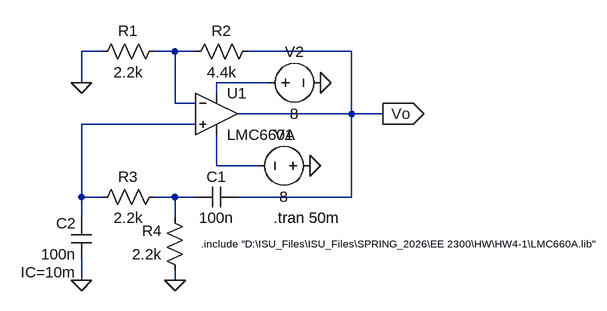
[diagram p0: schematic P4d.asc]
P4d.asc, the LTspice schematic file:
Version 4.1
SHEET 1 1140 680
WIRE 0 80 -32 80
WIRE 112 80 80 80
WIRE 144 80 112 80
WIRE 384 80 224 80
WIRE -32 128 -32 80
WIRE 256 128 176 128
WIRE 176 144 176 128
WIRE 112 160 112 80
WIRE 144 160 112 160
WIRE 384 176 384 80
WIRE 384 176 208 176
WIRE 432 176 384 176
WIRE 144 192 -32 192
WIRE 176 256 176 208
WIRE 240 256 176 256
WIRE -32 304 -32 192
WIRE 0 304 -32 304
WIRE 112 304 80 304
WIRE 144 304 112 304
WIRE 384 304 384 176
WIRE 384 304 208 304
WIRE -32 336 -32 304
WIRE 112 336 112 304
WIRE -32 432 -32 400
WIRE 112 432 112 416
FLAG -32 128 0
FLAG -32 432 0
FLAG 112 432 0
FLAG 432 176 Vo
IOPIN 432 176 Out
FLAG 336 128 0
FLAG 320 256 0
SYMBOL OpAmps\\opamp2 176 112 R0
SYMATTR InstName U1
SYMATTR Value LMC660A
SYMBOL res 96 64 R90
WINDOW 0 0 56 VBottom 2
WINDOW 3 32 56 VTop 2
SYMATTR InstName R1
SYMATTR Value 2.2k
SYMBOL res 240 64 R90
WINDOW 0 0 56 VBottom 2
WINDOW 3 32 56 VTop 2
SYMATTR InstName R2
SYMATTR Value 4.4k
SYMBOL res 96 288 R90
WINDOW 0 0 56 VBottom 2
WINDOW 3 32 56 VTop 2
SYMATTR InstName R3
SYMATTR Value 2.2k
SYMBOL res 128 432 R180
WINDOW 0 36 76 Left 2
WINDOW 3 36 40 Left 2
SYMATTR InstName R4
SYMATTR Value 2.2k
SYMBOL cap 208 288 R90
WINDOW 0 0 32 VBottom 2
WINDOW 3 32 32 VTop 2
SYMATTR InstName C1
SYMATTR Value 100n
SYMBOL cap -16 400 R180
WINDOW 0 24 56 Left 2
WINDOW 3 24 8 Left 2
WINDOW 39 24 -20 Left 2
SYMATTR InstName C2
SYMATTR Value 100n
SYMATTR SpiceLine IC=10m
SYMBOL voltage 336 256 R90
WINDOW 0 -32 56 VBottom 2
WINDOW 3 32 56 VTop 2
WINDOW 123 0 0 Left 0
WINDOW 39 0 0 Left 0
SYMATTR InstName V1
SYMATTR Value 8
SYMBOL voltage 240 128 R270
WINDOW 0 32 56 VTop 2
WINDOW 3 -32 56 VBottom 2
WINDOW 123 0 0 Left 0
WINDOW 39 0 0 Left 0
SYMATTR InstName V2
SYMATTR Value 8
TEXT 152 376 Left 1 !.include "D:\\ISU_Files\\ISU_Files\\SPRING_2026\\EE 2300\\HW\\HW4-1\\LMC660A.lib"
TEXT 264 336 Left 2 !.tran 50m

The netlist it stands for:
* P4d.asc
X§U1 N003 N001 N002 N004 Vo LMC660A  ; pins In+ In- V+ V- OUT
R1 N001 0 2.2k
R2 Vo N001 4.4k
R3 N005 N003 2.2k
R4 0 N005 2.2k
C1 Vo N005 100n
C2 0 N003 100n IC=10m
V1 0 N004 8
V2 N002 0 8
.include "D:\ISU_Files\ISU_Files\SPRING_2026\EE 2300\HW\HW4-1\LMC660A.lib"
.tran 50m
.backanno
.end